# Altium project Placa_EJ4.PrjPCB
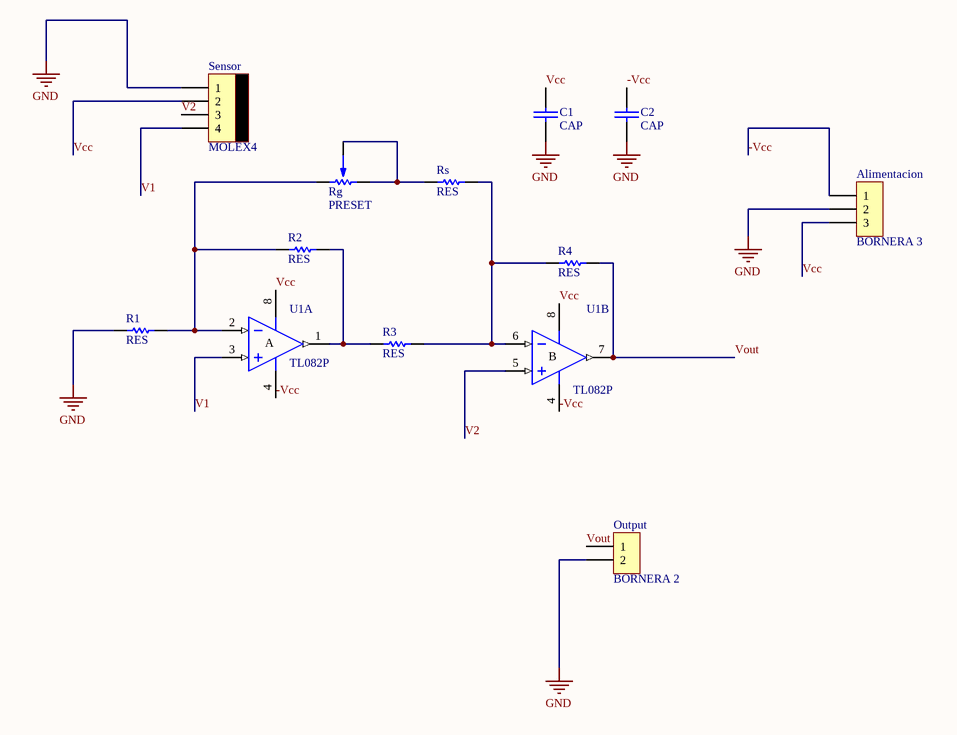
[diagram p0: Esquemarico.SchDoc]
1 sheet, 12 parts. Net scope: global (net labels, ports and power ports of the same name join across sheets).
Board files: PCB.PcbDoc, PlacaV2.PcbDoc

## Sheet Esquemarico.SchDoc
size A

### Parts
Alimentacion  BORNERA 3  [BORNERA3]
C1  CAP  [CAP100]
C2  CAP  [CAP100]
Output  BORNERA 2  [BORNERA2]
R1  RES  [0805]
R2  RES  [0805]
R3  RES  [0805]
R4  RES  [0805]
Rg  PRESET  [PRESET V]
Rs  RES  [0805]
Sensor  MOLEX4  [MOLEX4]
U1  TL082P  [P008]  (parts A,B of 2)

### Nets
GND: Alimentacion.2 C1.2 C2.2 Output.2 R1.1 Sensor.1
-Vcc: Alimentacion.1 C2.1 U1.4(V-)
V1: Sensor.4 U1.3(IN+)
V2: Sensor.3 U1.5(IN+)
Vcc: Alimentacion.3 C1.1 Sensor.2 U1.8(V+)
Vout: Output.1 R4.2 U1.7(OUT)
NetR1_2: R1.2 R2.1 Rg.1 U1.2(IN-)
NetR2_2: R2.2 R3.1 U1.1(OUT)
NetR3_2: R3.2 R4.1 Rs.2 U1.6(IN-)
NetRg_2: Rg.2 Rg.3 Rs.1

### Notes on the sheet
- (in symbol TL082P, part A) A
- (in symbol TL082P, part B) B

### Library data of the parts
U1 = TL082P: JFET-Input Operational Amplifier; Published: 16-Jan-2001; LatestRevisionDate: 04-Mar-2005; LatestRevisionNote: Stylized 3D Model Added.; DatasheetVersion: Feb-1999; PackageVersion: Jun-1999; PackageReference: P008; Publisher: Altium Limited; PackageDescription: DIP; 8 Leads; Row Spacing 7.62 mm; Pitch 2.54 mm; Code_JEDEC: MO-001-AN; ComponentLink1Description: Manufacturer Link; ComponentLink1URL: http://www.ti.com/; ComponentLink2Description: Datasheet; ComponentLink2URL: http://www-s.ti.com/sc/ds/tl082.pdf